# EAGLE design M32W.v1.0 (EAGLE 6.1)

## Sheet 1 of 3
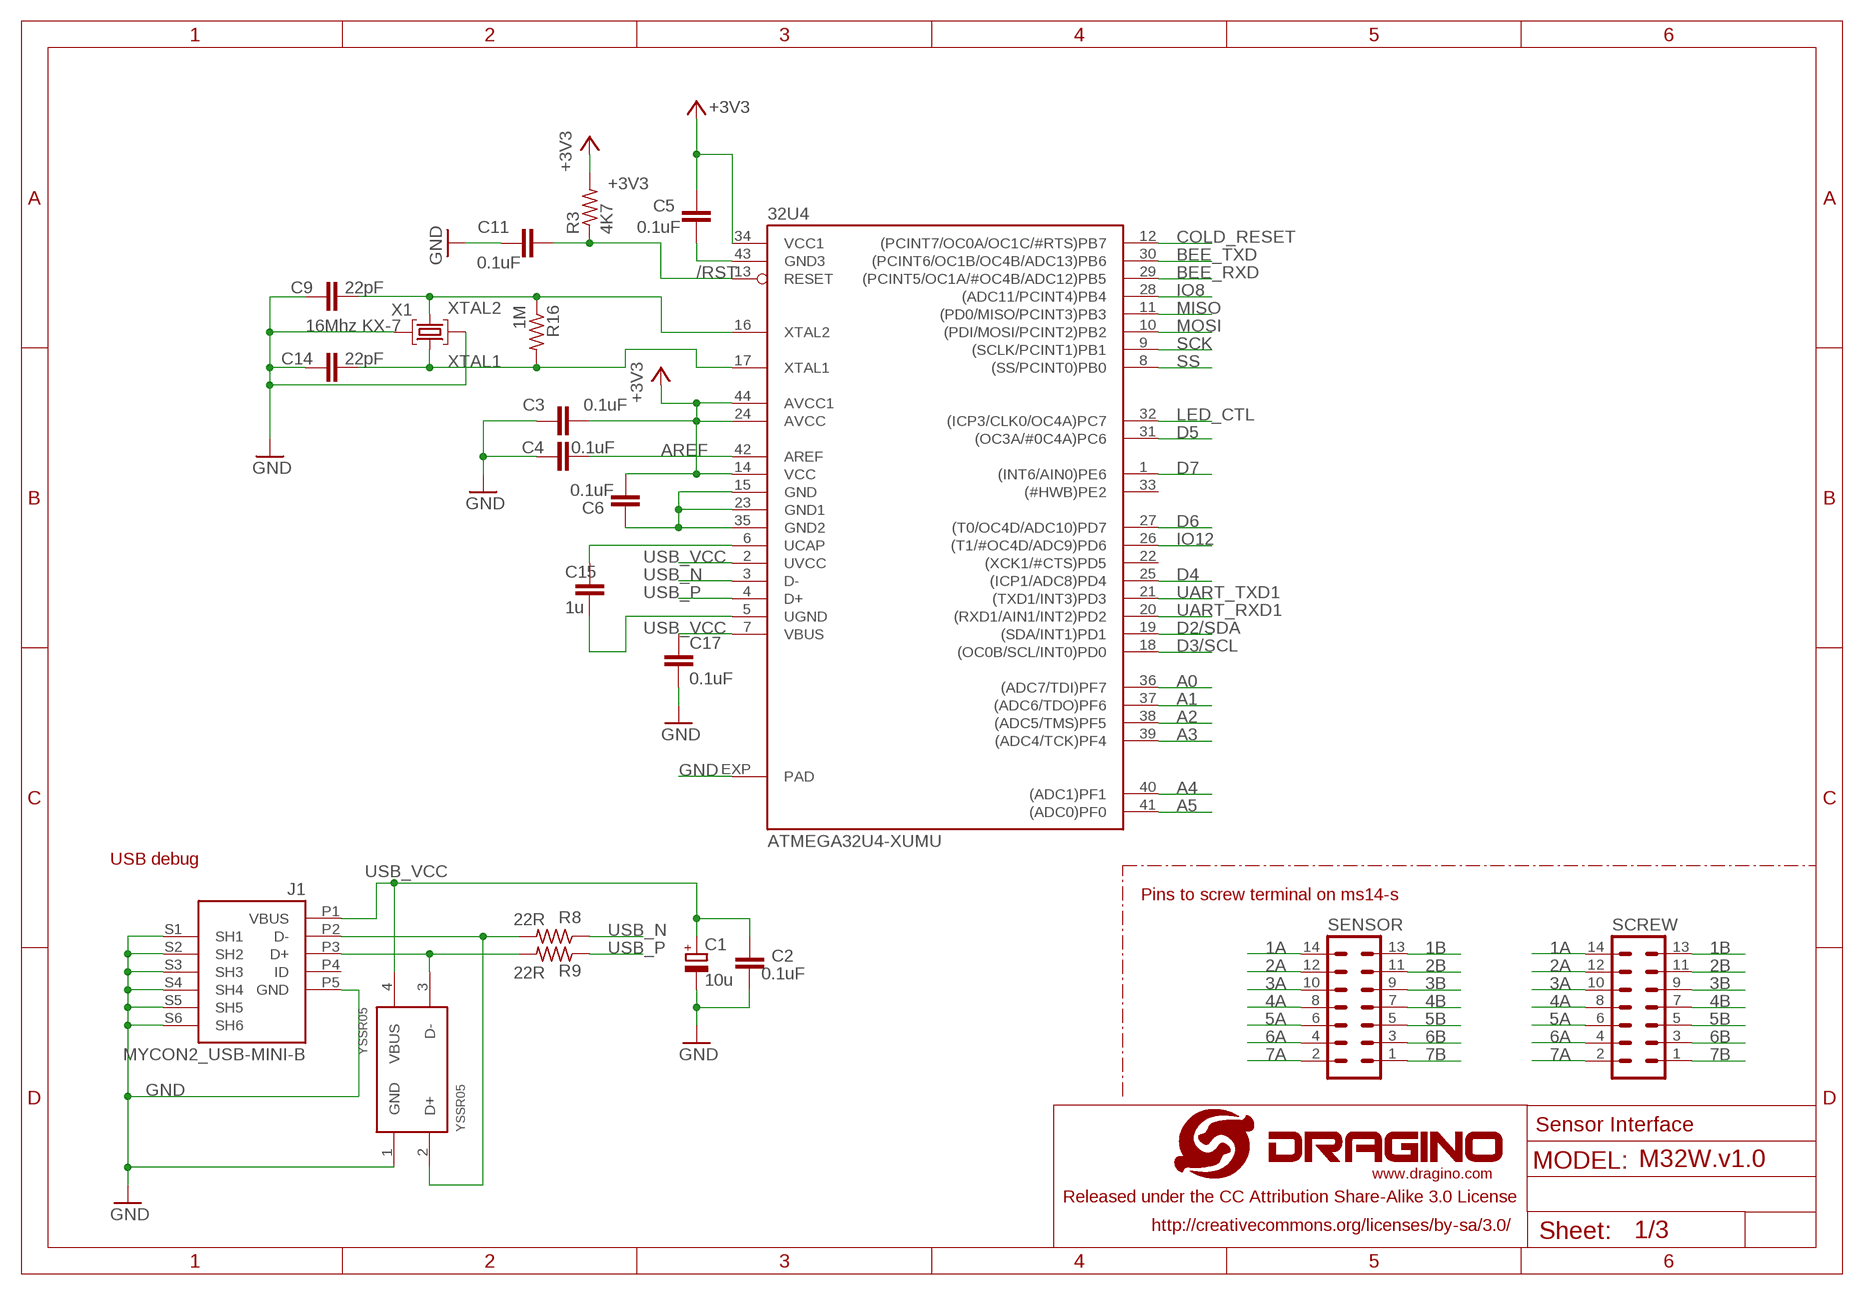
[diagram p0: schematic, sheet 1]

### Parts
32U4  ATMEGA32U4-XUMU  [QFN44ML7X7]
C1  10u  CPOL-EUSMCB  [SMC_B]
C2  0.1uF  C-EUC0402  [C0402]
C3  0.1uF  C-EUC0402  [C0402]
C4  0.1uF  C-EUC0402  [C0402]
C5  0.1uF  C-EUC0402  [C0402]
C6  0.1uF  C-EUC0402  [C0402]
C9  22pF  C-EUC0402  [C0402]
C11  0.1uF  C-EUC0402  [C0402]
C14  22pF  C-EUC0402  [C0402]
C15  1u  C-EUC0402  [C0402]
C17  0.1uF  C-EUC0402  [C0402]
J1  MYCON2_USB-MINI-B  [CON2_USB_MICRO_B_AT]
R3  4K7  R-US_R0402  [R0402]
R8  22R  R-US_R0402  [R0402]
R9  22R  R-US_R0402  [R0402]
R16  1M  R-US_R0402  [R0402]
SCREW  MA07-2  [MA07-2]
SENSOR  MA07-2  [MA07-2]
X1  16Mhz KX-7  CRYSTAL-3.2-2.5  [CRYSTAL-3.2-2.5]
YSSR05  YSSR05  [SOT143]

### Nets
1A: SCREW.14 SENSOR.14
1B: SCREW.13 SENSOR.13
2A: SCREW.12 SENSOR.12
2B: SCREW.11 SENSOR.11
3A: SCREW.10 SENSOR.10
3B: SCREW.9 SENSOR.9
4A: SCREW.8 SENSOR.8
4B: SCREW.7 SENSOR.7
5A: SCREW.6 SENSOR.6
5B: SCREW.5 SENSOR.5
6A: SCREW.4 SENSOR.4
6B: SCREW.3 SENSOR.3
7A: SCREW.2 SENSOR.2
7B: SCREW.1 SENSOR.1
+3V3: 32U4.14(VCC) 32U4.24(AVCC) 32U4.34(VCC1) 32U4.44(AVCC1) C3.2 C5.1 C6.2 R3.2 ; also sheet 2,3
/RST: 32U4.13(RESET) C11.1 R3.1 ; also sheet 2
A0: 32U4.36((ADC7/TDI)PF7) ; also sheet 2
A1: 32U4.37((ADC6/TDO)PF6) ; also sheet 2
A2: 32U4.38((ADC5/TMS)PF5) ; also sheet 2
A3: 32U4.39((ADC4/TCK)PF4) ; also sheet 2
A4: 32U4.40((ADC1)PF1) ; also sheet 2
A5: 32U4.41((ADC0)PF0) ; also sheet 2
AREF: 32U4.42(AREF) C4.2
BEE_RXD: 32U4.29((PCINT5/OC1A/#OC4B/ADC12)PB5) ; also sheet 2,3
BEE_TXD: 32U4.30((PCINT6/OC1B/OC4B/ADC13)PB6) ; also sheet 2,3
COLD_RESET: 32U4.12((PCINT7/OC0A/OC1C/#RTS)PB7) ; also sheet 2
D2/SDA: 32U4.19((SDA/INT1)PD1) ; also sheet 2
D3/SCL: 32U4.18((OC0B/SCL/INT0)PD0) ; also sheet 2,3
D4: 32U4.25((ICP1/ADC8)PD4) ; also sheet 2
D5: 32U4.31((OC3A/#0C4A)PC6) ; also sheet 2
D6: 32U4.27((T0/OC4D/ADC10)PD7) ; also sheet 2
D7: 32U4.1((INT6/AIN0)PE6)
GND [gnd]: 32U4.5(UGND) 32U4.15(GND) 32U4.23(GND1) 32U4.35(GND2) 32U4.43(GND3) 32U4.EXP(PAD) C1.- C2.2 C3.1 C4.1 C5.2 C6.1 C9.1 C11.2 C14.1 C15.1 C17.1 J1.P5(GND) J1.S1(SH1) J1.S2(SH2) J1.S3(SH3) J1.S4(SH4) J1.S5(SH5) J1.S6(SH6) X1.2(GND) X1.4(GND) YSSR05.1(GND) ; also sheet 2,3
IO8: 32U4.28((ADC11/PCINT4)PB4) ; also sheet 2
IO12: 32U4.26((T1/#OC4D/ADC9)PD6) ; also sheet 2
LED_CTL: 32U4.32((ICP3/CLK0/OC4A)PC7) ; also sheet 2
MISO: 32U4.11((PD0/MISO/PCINT3)PB3) ; also sheet 2,3
MOSI: 32U4.10((PDI/MOSI/PCINT2)PB2) ; also sheet 2,3
N$1: 32U4.6(UCAP) C15.2
N$2_N [usbtrace]: J1.P3(D+) R9.2 YSSR05.3(D-)
N$2_P [usbtrace]: J1.P2(D-) R8.2 YSSR05.2(D+)
SCK: 32U4.9((SCLK/PCINT1)PB1) ; also sheet 2,3
SS: 32U4.8((SS/PCINT0)PB0) ; also sheet 2,3
UART_RXD1: 32U4.20((RXD1/AIN1/INT2)PD2) ; also sheet 2
UART_TXD1: 32U4.21((TXD1/INT3)PD3) ; also sheet 2
USB_N [usbtrace]: 32U4.3(D-) R8.1
USB_P [usbtrace]: 32U4.4(D+) R9.1
USB_VCC: 32U4.2(UVCC) 32U4.7(VBUS) C1.+ C2.1 C17.2 J1.P1(VBUS) YSSR05.4(VBUS)
XTAL1: 32U4.17(XTAL1) C14.2 R16.2 X1.3(C2)
XTAL2: 32U4.16(XTAL2) C9.2 R16.1 X1.1(C1)
Unconnected: 32U4.22((XCK1/#CTS)PD5) 32U4.33((#HWB)PE2) J1.P4(ID)

### Notes on the sheet
- USB debug
- Pins to screw terminal on ms14-s
- Sensor Interface

## Sheet 2 of 3
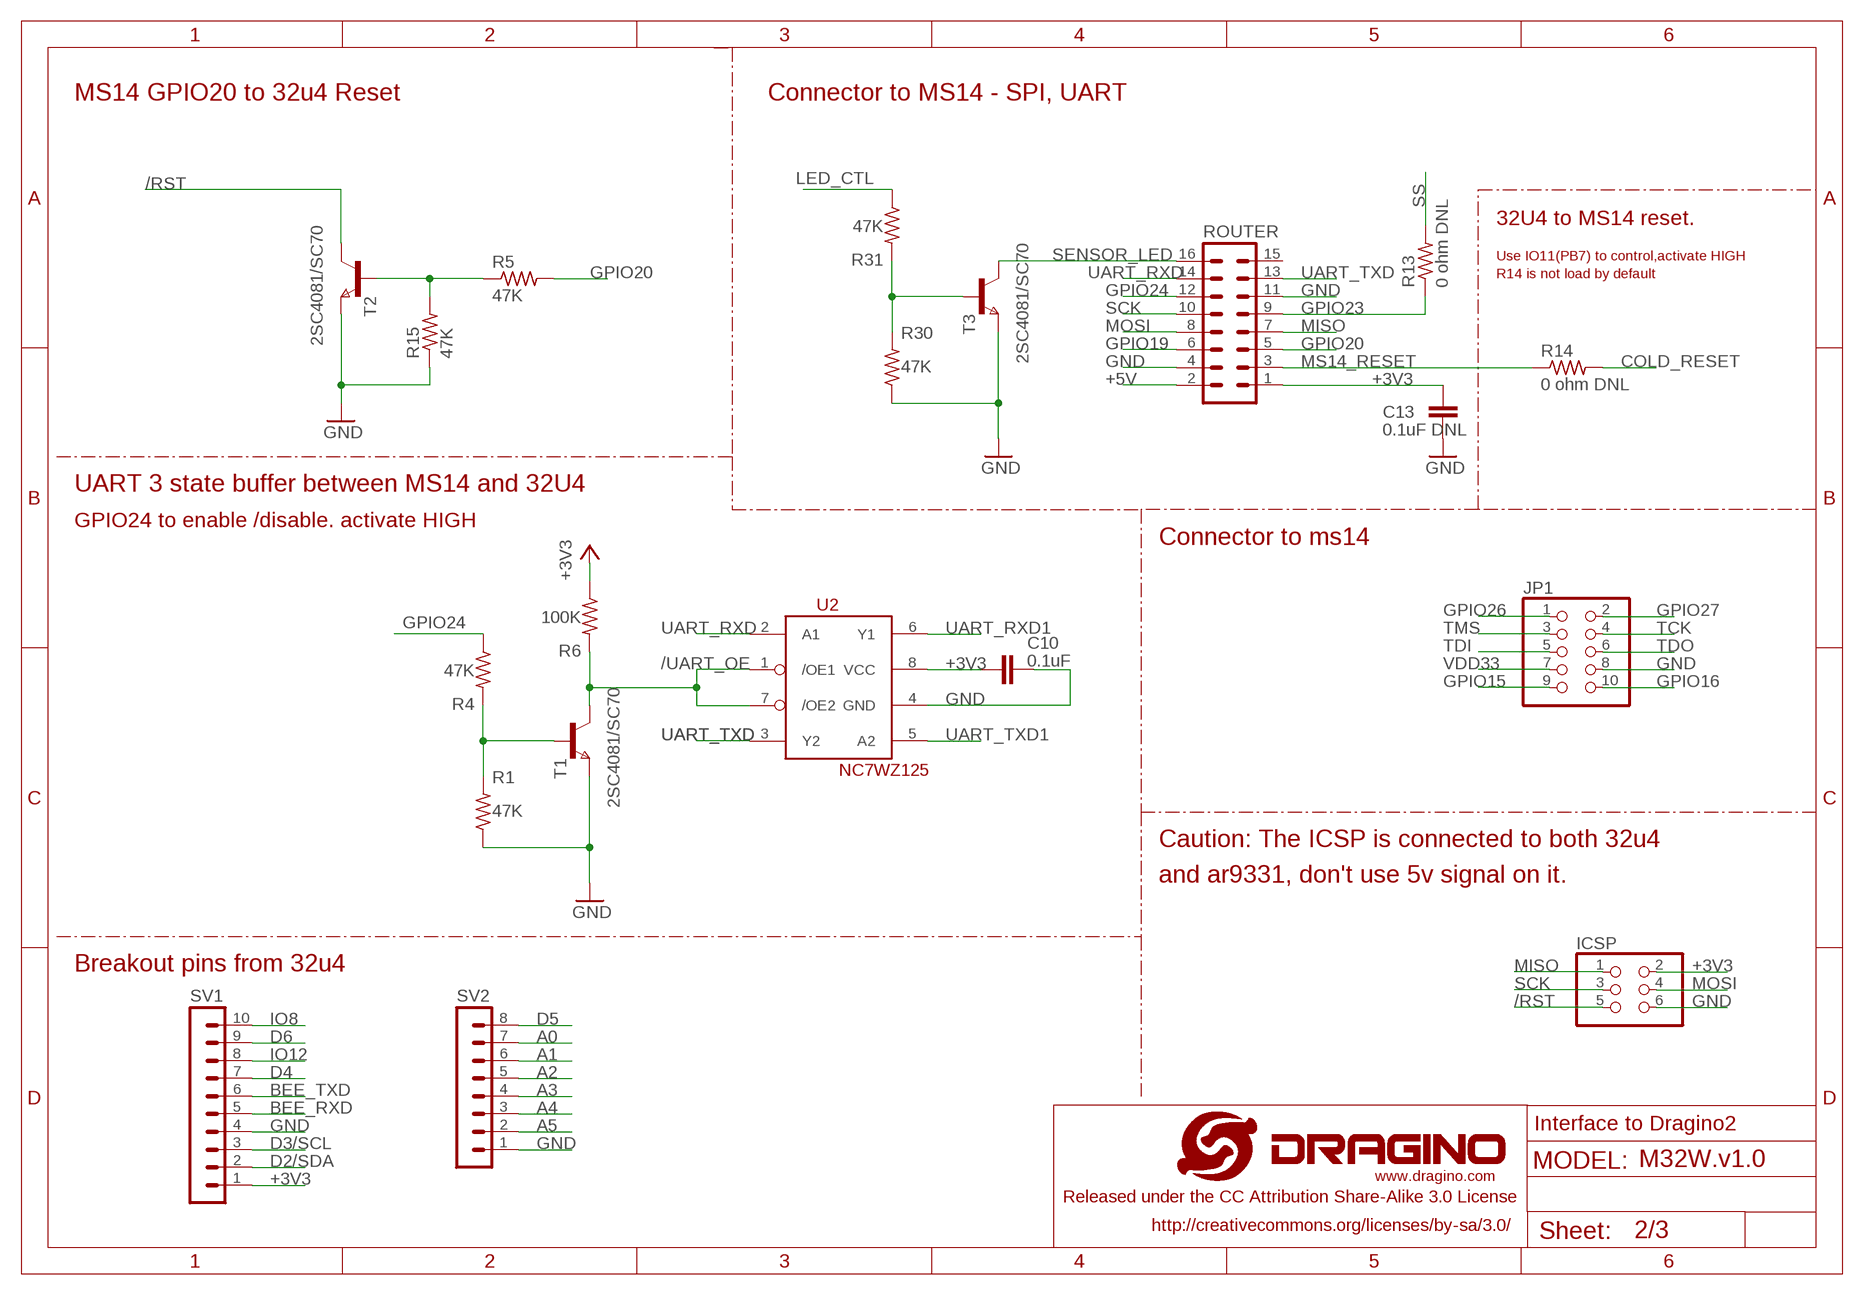
[diagram p1: schematic, sheet 2]

### Parts
C10  0.1uF  C-EUC0402  [C0402]
C13  0.1uF DNL  C-EUC0402  [C0402]
ICSP  PINHD-2X3  [2X03]
JP1  PINHD-2X5_2.00  [2X05M]
R1  47K  R-US_R0402  [R0402]
R4  47K  R-US_R0402  [R0402]
R5  47K  R-US_R0402  [R0402]
R6  100K  R-US_R0402  [R0402]
R13  0 ohm DNL  R-US_R0402  [R0402]
R14  0 ohm DNL  R-US_R0402  [R0402]
R15  47K  R-US_R0402  [R0402]
R30  47K  R-US_R0402  [R0402]
R31  47K  R-US_R0402  [R0402]
ROUTER  MA08-2  [MA08-2]
SV1  MA10-1  [MA10-1]
SV2  MA08-1  [MA08-1]
T1  2SC4081/SC70  NPNSOT323  [SOT323]
T2  2SC4081/SC70  NPNSOT323  [SOT323]
T3  2SC4081/SC70  NPNSOT323  [SOT323]
U2  NC7WZ125  [US8]
U$5  LOGO-NEW  [LOGO-SILK-NEW]

### Nets
+3V3: C10.2 C13.1 ICSP.2 R6.1 ROUTER.1 SV1.1 U2.8(VCC) ; also sheet 1,3
+5V: ROUTER.2
/RST: ICSP.5 T2.1(C) ; also sheet 1
/UART_OE: R6.2 T1.1(C) U2.1(/OE1) U2.7(/OE2)
A0: SV2.7 ; also sheet 1
A1: SV2.6 ; also sheet 1
A2: SV2.5 ; also sheet 1
A3: SV2.4 ; also sheet 1
A4: SV2.3 ; also sheet 1
A5: SV2.2 ; also sheet 1
BEE_RXD: SV1.5 ; also sheet 1,3
BEE_TXD: SV1.6 ; also sheet 1,3
COLD_RESET: R14.2 ; also sheet 1
D2/SDA: SV1.2 ; also sheet 1
D3/SCL: SV1.3 ; also sheet 1,3
D4: SV1.7 ; also sheet 1
D5: SV2.8 ; also sheet 1
D6: SV1.9 ; also sheet 1
GND [gnd]: C10.1 C13.2 ICSP.6 JP1.8 R1.1 R15.1 R30.1 ROUTER.4 ROUTER.11 SV1.4 SV2.1 T1.3(E) T2.3(E) T3.3(E) U2.4(GND) ; also sheet 1,3
GPIO15: JP1.9
GPIO16: JP1.10
GPIO19: ROUTER.6
GPIO20: R5.2 ROUTER.5
GPIO23: R13.1 ROUTER.9
GPIO24: R4.1 ROUTER.12
GPIO26: JP1.1 ; also sheet 3
GPIO27: JP1.2 ; also sheet 3
IO8: SV1.10 ; also sheet 1
IO12: SV1.8 ; also sheet 1
LED_CTL: R31.1 ; also sheet 1
MISO: ICSP.1 ROUTER.7 ; also sheet 1,3
MOSI: ICSP.4 ROUTER.8 ; also sheet 1,3
MS14_RESET: R14.1 ROUTER.3
N$4: R1.2 R4.2 T1.2(B)
N$8: R5.1 R15.2 T2.2(B)
N$9: R30.2 R31.2 T3.2(B)
SCK: ICSP.3 ROUTER.10 ; also sheet 1,3
SENSOR_LED: ROUTER.16 T3.1(C)
SS: R13.2 ; also sheet 1,3
TCK: JP1.4
TDI: JP1.5
TDO: JP1.6
TMS: JP1.3
UART_RXD: ROUTER.14 U2.2(A1) ; also sheet 3
UART_RXD1: U2.6(Y1) ; also sheet 1
UART_TXD: ROUTER.13 U2.3(Y2) ; also sheet 3
UART_TXD1: U2.5(A2) ; also sheet 1
VDD33: JP1.7
Unconnected: ROUTER.15

### Notes on the sheet
- MS14 GPIO20 to 32u4 Reset | Connector to MS14 - SPI, UART
- 32U4 to MS14 reset.
- Use IO11(PB7) to control,activate HIGH
- R14 is not load by default
- UART 3 state buffer between MS14 and 32U4
- GPIO24 to enable /disable. activate HIGH
- Connector to ms14
- Caution: The ICSP is connected to both 32u4
- and ar9331, don't use 5v signal on it.
- Breakout pins from 32u4
- Interface to Dragino2

## Sheet 3 of 3
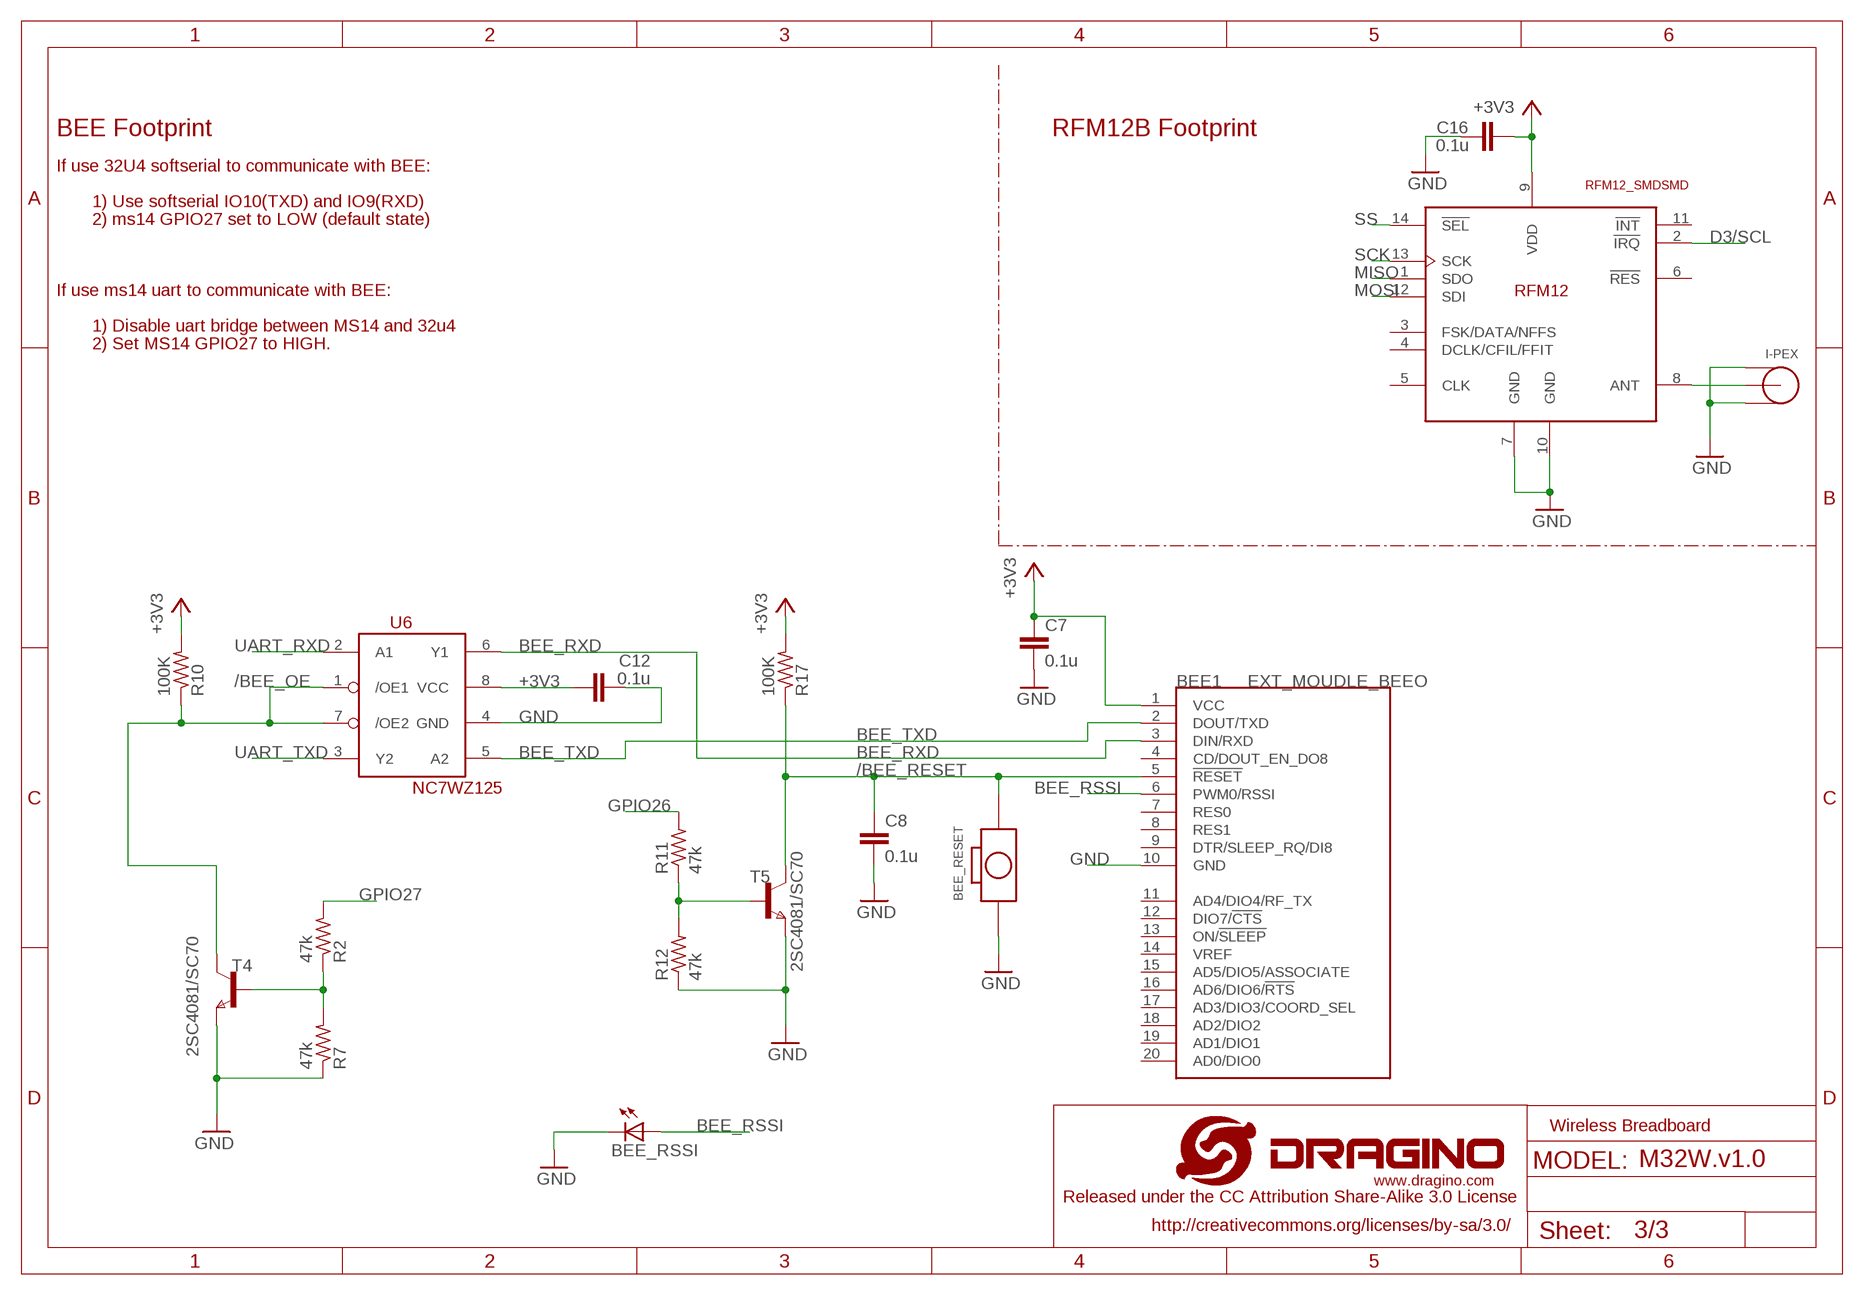
[diagram p2: schematic, sheet 3]

### Parts
BEE1  EXT_MOUDLE_BEEO  [EXT_MOUDLE_BEE]
BEE_RESET  CPT_SMD_BOTTON_1_SMD  [CPT_SMD_BOTTON_1]
BEE_RSSI  LEDCHIP-LED0805  [CHIP-LED0805]
C7  0.1u  C-EUC0402  [C0402]
C8  0.1u  C-EUC0402  [C0402]
C12  0.1u  C-EUC0402  [C0402]
C16  0.1u  C-EUC0402  [C0402]
I-PEX  I-PEX  [I-PEX]
R2  47k  R-US_R0402  [R0402]
R7  47k  R-US_R0402  [R0402]
R10  100K  R-US_R0402  [R0402]
R11  47k  R-US_R0402  [R0402]
R12  47k  R-US_R0402  [R0402]
R17  100K  R-US_R0402  [R0402]
T4  2SC4081/SC70  NPNSOT323  [SOT323]
T5  2SC4081/SC70  NPNSOT323  [SOT323]
U6  NC7WZ125  [US8]
U$3  RFM12_SMDSMD  [RFM12]

### Nets
+3V3: BEE1.1(VCC) C7.1 C12.1 C16.2 R10.2 R17.2 U6.8(VCC) U$3.9(VDD) ; also sheet 1,2
/BEE_OE: R10.1 T4.1(C) U6.1(/OE1) U6.7(/OE2)
/BEE_RESET: BEE1.5(!RESET) BEE_RESET.P$2 C8.1 R17.1 T5.1(C)
BEE_RSSI: BEE1.6(PWM0/RSSI) BEE_RSSI.A
BEE_RXD: BEE1.3(DIN/RXD) U6.6(Y1) ; also sheet 1,2
BEE_TXD: BEE1.2(DOUT/TXD) U6.5(A2) ; also sheet 1,2
D3/SCL: U$3.2(!IRQ) ; also sheet 1,2
GND [gnd]: BEE1.10(GND) BEE_RESET.1 BEE_RSSI.C C7.2 C8.2 C12.2 C16.1 I-PEX.GND I-PEX.GND1 R7.1 R12.1 T4.3(E) T5.3(E) U6.4(GND) U$3.7(GND) U$3.10(GND) ; also sheet 1,2
GPIO26: R11.2 ; also sheet 2
GPIO27: R2.2 ; also sheet 2
MISO: U$3.1(SDO) ; also sheet 1,2
MOSI: U$3.12(SDI) ; also sheet 1,2
N$11: R2.1 R7.2 T4.2(B)
N$12: R11.1 R12.2 T5.2(B)
N$16: I-PEX.SIG U$3.8(ANT)
SCK: U$3.13(SCK) ; also sheet 1,2
SS: U$3.14(!SEL) ; also sheet 1,2
UART_RXD: U6.2(A1) ; also sheet 2
UART_TXD: U6.3(Y2) ; also sheet 2
Unconnected: BEE1.4(CD/DOUT_EN_DO8) BEE1.7(RES0) BEE1.8(RES1) BEE1.9(DTR/SLEEP_RQ/DI8) BEE1.11(AD4/DIO4/RF_TX) BEE1.12(DIO7/!CTS) BEE1.13(ON/!SLEEP) BEE1.14(VREF) BEE1.15(AD5/DIO5/ASSOCIATE) BEE1.16(AD6/DIO6/!RTS) BEE1.17(AD3/DIO3/COORD_SEL) BEE1.18(AD2/DIO2) BEE1.19(AD1/DIO1) BEE1.20(AD0/DIO0) U$3.3(FSK/DATA/NFFS) U$3.4(DCLK/CFIL/FFIT) U$3.5(CLK) U$3.6(!RES) U$3.11(!INT)

### Notes on the sheet
- BEE Footprint | RFM12B Footprint
- If use 32U4 softserial to communicate with BEE:
- 1) Use softserial IO10(TXD) and IO9(RXD)
- 2) ms14 GPIO27 set to LOW (default state)
- If use ms14 uart to communicate with BEE:
- 1) Disable uart bridge between MS14 and 32u4
- 2) Set MS14 GPIO27 to HIGH.
- Wireless Breadboard

## Library data of the parts
32U4 = dragino:ATMEGA32U4-XU
BEE1 = Bees_Shield:EXT_MOUDLE_BEE
BEE_RESET = Bees_Shield:CPT_SMD_BOTTON_1
BEE_RSSI = dragino:LED: LED OSRAM: - CHIPLED LG R971, LG N971, LY N971, LG Q971, LY Q971, LO R971, LY R971 LH N974, LH R974 LS Q976, LO Q976, LY Q976 LO Q996 - Hyper CHIPLED LW Q18S LB Q993, LB Q99A, LB R99A - SideLED LS A670, LO A670, LY A670, LG A670, LP A670 LB A673, LV A673, LT A673, LW A673 LH A674 LY A675 LS A676, LA A676, LO A676, LY A676, LW A676 LS A679, LY A679, LG A679 - Hyper Micro SIDELED® LS Y876, LA Y876, LO Y876, LY Y876 LT Y87S - SmartLED LW L88C, LW L88S LB L89C, LB L89S, LG L890 LS L89K, LO L89K, LY L89K LS L896, LA L896, LO L896, LY L896 - TOPLED LS T670, LO T670, LY T670, LG T670, LP T670 LSG T670, LSP T670, LSY T670, LOP T670, LYG T670 LG T671, LOG T671, LSG T671 LB T673, LV T673, LT T673, LW T673 LH T674 LS T676, LA T676, LO T676, LY T676, LB T676, LH T676, LSB T676, LW T676 LB T67C, LV T67C, LT T67C, LS T67K, LO T67K, LY T67K, LW E67C LS E67B, LA E67B, LO E67B, LY E67B, LB E67C, LV E67C, LT E67C LW T67C LS T679, LY T679, LG T679 LS T770, LO T770, LY T770, LG T770, LP T770 LB T773, LV T773, LT T773, LW T773 LH T774 LS E675, LA E675, LY E675, LS T675 LS T776, LA T776, LO T776, LY T776, LB T776 LHGB T686 LT T68C, LB T68C - Hyper Mini TOPLED® LB M676 - Mini TOPLED Santana® LG M470 LS M47K, LO M47K, LY M47K Source: http://www.osram.convergy.de LUXEON: - LUMILED® LXK2-PW12-R00, LXK2-PW12-S00, LXK2-PW14-U00, LXK2-PW14-V00 LXK2-PM12-R00, LXK2-PM12-S00, LXK2-PM14-U00 LXK2-PE12-Q00, LXK2-PE12-R00, LXK2-PE12-S00, LXK2-PE14-T00, LXK2-PE14-U00 LXK2-PB12-K00, LXK2-PB12-L00, LXK2-PB12-M00, LXK2-PB14-N00, LXK2-PB14-P00, LXK2-PB14-Q00 LXK2-PR12-L00, LXK2-PR12-M00, LXK2-PR14-Q00, LXK2-PR14-R00 LXK2-PD12-Q00, LXK2-PD12-R00, LXK2-PD12-S00 LXK2-PH12-R00, LXK2-PH12-S00 LXK2-PL12-P00, LXK2-PL12-Q00, LXK2-PL12-R00 Source: www.luxeon.com KINGBRIGHT: KA-3528ASYC Source: www.kingbright.com
C1 = rcl:CPOL-EU: POLARIZED CAPACITOR, European symbol
C2-C17 = dragino:C-EU: CAPACITOR, European symbol
I-PEX = dragino:I-PEX: I-PEX connector
ICSP = dragino:PINHD-2X3: PIN HEADER
J1 = SmartPrj:MYCON2_USB-MINI-B
JP1 = dragino:PINHD-2X5: PIN HEADER
R1-R17 R30 R31 = dragino:R-US_: RESISTOR, American symbol
ROUTER = dragino:MA08-2: PIN HEADER; OC_FARNELL: unknown; OC_NEWARK: unknown
SCREW SENSOR = dragino:MA07-2: PIN HEADER; OC_FARNELL: unknown; OC_NEWARK: unknown
SV1 = con-lstb:MA10-1: PIN HEADER; OC_FARNELL: unknown; OC_NEWARK: unknown
SV2 = con-lstb:MA08-1: PIN HEADER; OC_FARNELL: unknown; OC_NEWARK: unknown
T1-T5 = zetex:NPNSOT323: NPN TRANSISTOR; MPN: DSS4160U-7; OC_FARNELL: 1710696; OC_NEWARK: 25R4558
U2 U6 = dragino:NC7WZ125: 3 state buffer: http://www.fairchildsemi.com/ds/NC/NC7WZ125.pdf
U$3 = dragino:RFM12_SMD: RFM12 is a low costing ISM band transceiver module implemented with unique PLL. It works signal ranges from 315/433/868/915MHZ bands, comply with FCC, ETSI regulation. The SPI interface is used to communicate with microcontroller for parameter setting.
U$5 = dragino:LOGO-NEW
X1 = SmartPrj:CRYSTAL-3.2-2.5
YSSR05 = dragino:YSSR05: Yeashin LOW CAPACITANCE TVS DIODE ARRAY http://www.yeashin.tw/download.php?id=4588

## Net classes
0 default: width 0.203 mm, clearance 0.254 mm
1 power: width 0.61 mm, drill 0.61 mm, clearance 0.254 mm
2 gnd: width 0.305 mm, drill 0.33 mm, clearance 0.254 mm
3 usbvcc: width 0.508 mm, drill 0.61 mm, clearance 0.254 mm
4 aref: width 0.406 mm, drill 0.61 mm, clearance 0.254 mm
5 usbtrace: width 0.254 mm, clearance 0.152 mm

## Board
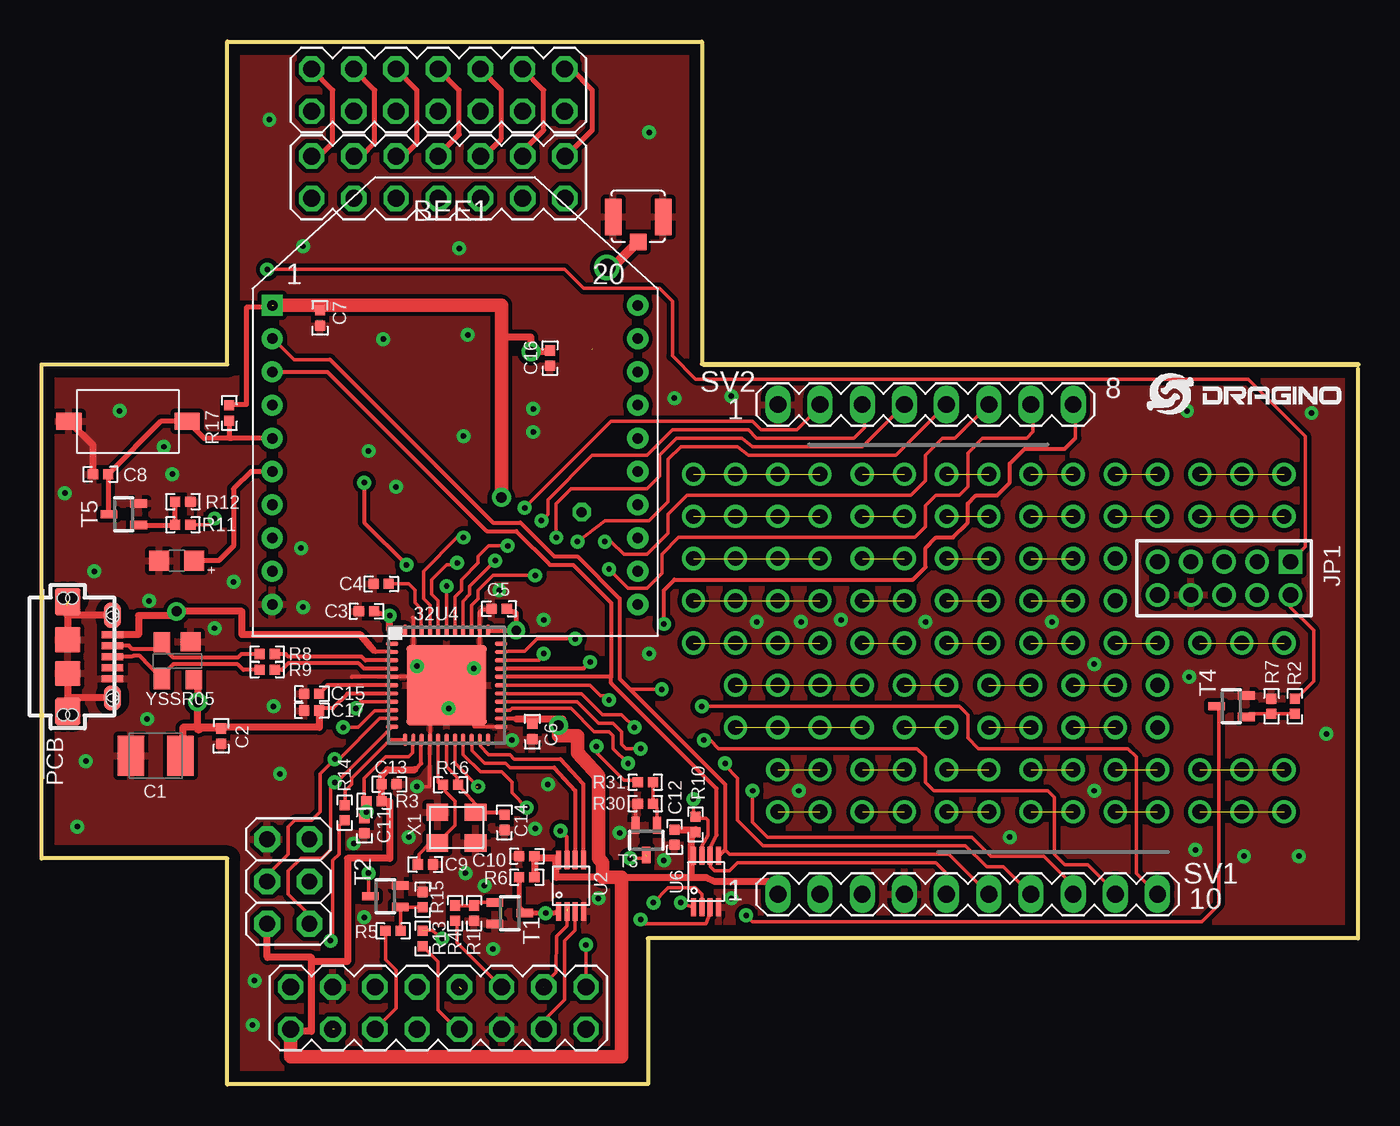
[diagram p3: board, top side]
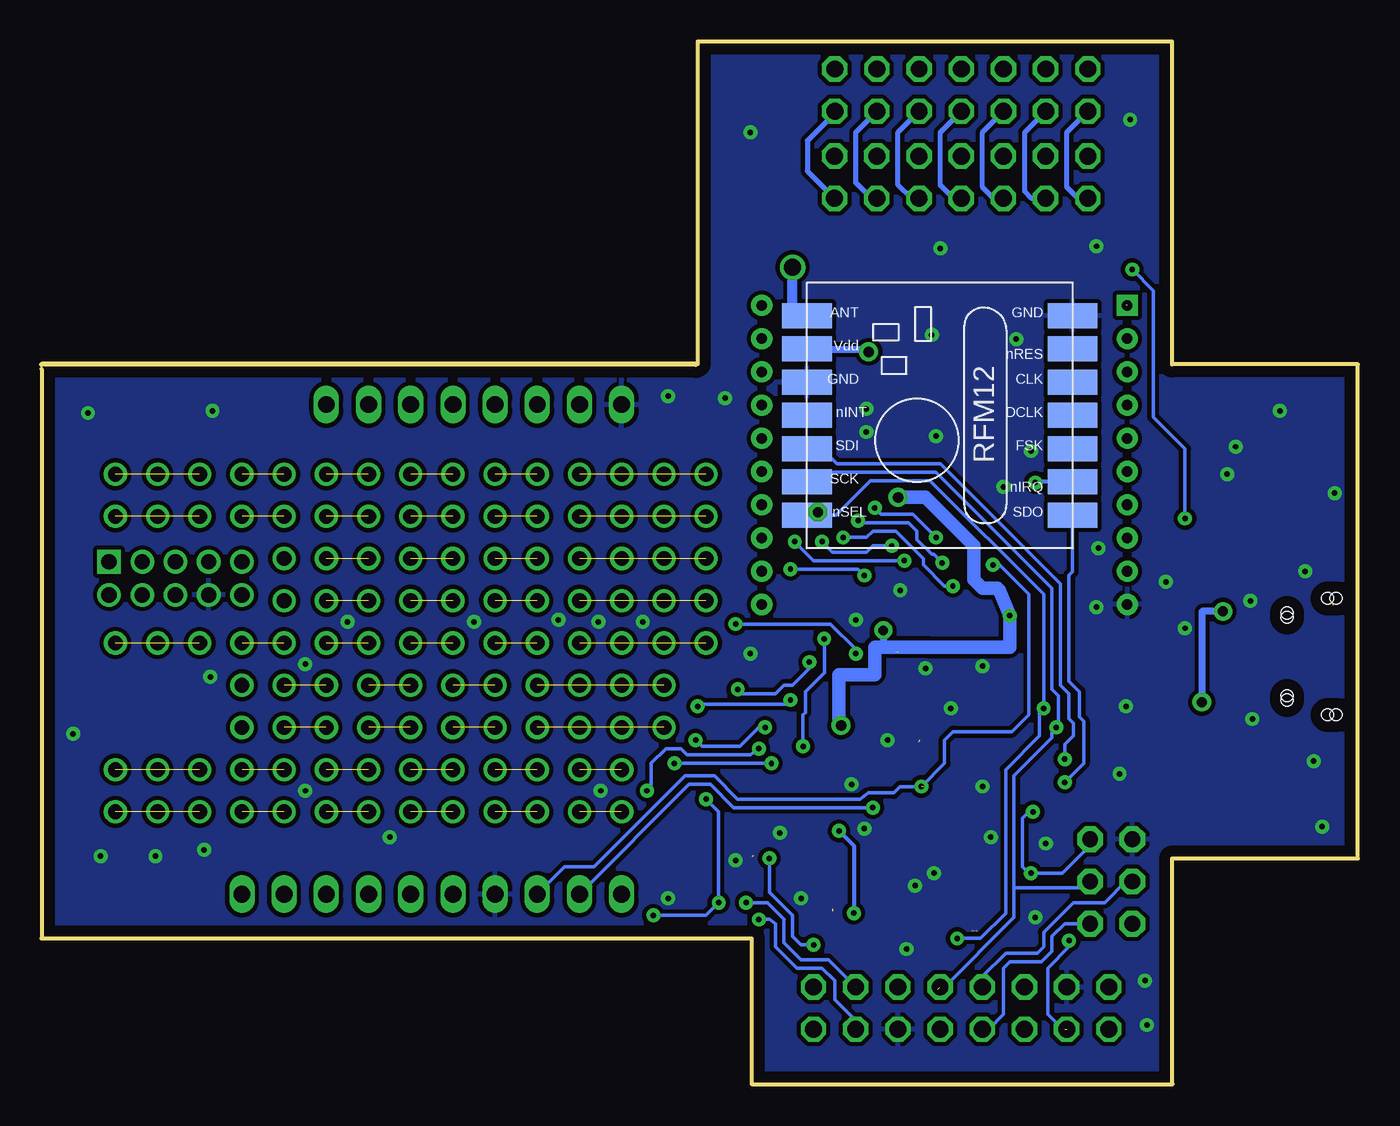
[diagram p4: board, bottom side, seen from below]

Size 79.25 x 62.75 mm. Coordinates in mm from the lower left corner, seen from the top.
Outline: 39.75,43.36 39.75,62.75 11.18,62.75 11.18,43.32 0,43.32 0,13.6 11.18,13.6 11.18,0
Outline: 79.25,43.04 79.25,8.78 36.51,8.78 36.51,0.02 11.16,0.02
Outline: 39.88,43.32 79.25,43.32
Copper layers (1*16): Top 0.035mm / dielectric 1.5mm / Bottom 0.035mm
Design rules: minimum track width 5mil, minimum drill 10mil, track to track 6mil, track to pad 7mil, pad to pad 7mil, via to via 10mil, smd to smd 7mil, copper to edge 26mil, drill to drill 10mil, minimum pad ring 10mil, minimum via ring 10mil, stop-mask expansion 1mil, vias tented up to drill 30mil, thermal gap 10mil

### Footprints (pad centres in the part's own frame; a part is rotated, then mirrored left to right if it is on the bottom)
QFN44ML7X7 = smd 0.75 x 0.275: 1 -3.275,2.5; 2 -3.275,2; 3 -3.275,1.5; 4 -3.275,1; 5 -3.275,0.5; 6 -3.275,0; 7 -3.275,-0.5; 8 -3.275,-1; 9 -3.275,-1.5; 10 -3.275,-2; 11 -3.275,-2.5; 23 3.275,-2.5; 24 3.275,-2; 25 3.275,-1.5; 26 3.275,-1; 27 3.275,-0.5; 28 3.275,0; 29 3.275,0.5; 30 3.275,1; 31 3.275,1.5; 32 3.275,2; 33 3.275,2.5 | smd 0.275 x 0.75: 12 -2.5,-3.275; 13 -2,-3.275; 14 -1.5,-3.275; 15 -1,-3.275; 16 -0.5,-3.275; 17 0,-3.275; 18 0.5,-3.275; 19 1,-3.275; 20 1.5,-3.275; 21 2,-3.275; 22 2.5,-3.275; 34 2.5,3.275; 35 2,3.275; 36 1.5,3.275; 37 1,3.275; 38 0.5,3.275; 39 0,3.275; 40 -0.5,3.275; 41 -1,3.275; 42 -1.5,3.275; 43 -2,3.275; 44 -2.5,3.275 | smd 4.826 x 4.826: EXP 0,0
EXT_MOUDLE_BEE = drill 0.635 pad 1.27 square: 1 -11,0 | drill 0.635 pad 1.27: 2 -11,-2; 3 -11,-4; 4 -11,-6; 5 -11,-8; 6 -11,-10; 7 -11,-12; 8 -11,-14; 9 -11,-16; 10 -11,-18; 11 11,-18; 12 11,-16; 13 11,-14; 14 11,-12; 15 11,-10; 16 11,-8; 17 11,-6; 18 11,-4; 19 11,-2; 20 11,0
CPT_SMD_BOTTON_1 = smd 1.524 x 1.016: 1 -3.556,0; P$2 3.556,0
CHIP-LED0805 = smd 1.2 x 1.2: A 0,-1.05; C 0,1.05
SMC_B = smd 1.6 x 2.4: + -1.5,0; - 1.5,0
C0402 = smd 0.61 x 0.61: 1 -0.457,0; 2 0.457,0
I-PEX = smd 1 x 2.2: GND -1.65,-0.27; GND1 1.35,-0.27 | smd 1 x 1: SIG -0.15,-1.77
2X03 = drill 0.95 pad 1.55 octagon: 1 -2.54,-1.27; 2 -2.54,1.27; 3 0,-1.27; 4 0,1.27; 5 2.54,-1.27; 6 2.54,1.27
CON2_USB_MICRO_B_AT = smd 0.406 x 1.346: P1 -1.321,2.692; P2 -0.66,2.692; P3 0,2.692; P4 0.66,2.692; P5 1.321,2.692 | smd 1.651 x 1.549: S1 -3.302,0; S2 3.302,0 | smd 1.524 x 1.016: S3 -2.489,2.692; S4 2.489,2.692 | smd 1.524 x 1.524: S5 -1.016,0; S6 1.016,0 | hole 0.7: -3.505,0.254; -3.505,-0.254; 3.505,0.254; 3.505,-0.254; -2.616,2.692; -2.362,2.692; 2.362,2.692; 2.616,2.692
2X05M = drill 0.914 square: 1 -4,-1 | drill 0.914: 2 -4,1; 3 -2,-1; 4 -2,1; 5 0,-1; 6 0,1; 7 2,-1; 8 2,1; 9 4,-1; 10 4,1
R0402 = smd 0.61 x 0.61: 1 -0.457,0; 2 0.457,0
MA08-2 = drill 1.016 octagon: 1 -8.89,-1.27; 2 -8.89,1.27; 3 -6.35,-1.27; 4 -6.35,1.27; 5 -3.81,-1.27; 6 -3.81,1.27; 7 -1.27,-1.27; 8 -1.27,1.27; 9 1.27,-1.27; 10 1.27,1.27; 11 3.81,-1.27; 12 3.81,1.27; 13 6.35,-1.27; 14 6.35,1.27; 15 8.89,-1.27; 16 8.89,1.27
MA07-2 = drill 1.016 octagon: 1 -7.62,-1.27; 2 -7.62,1.27; 3 -5.08,-1.27; 4 -5.08,1.27; 5 -2.54,-1.27; 6 -2.54,1.27; 7 0,-1.27; 8 0,1.27; 9 2.54,-1.27; 10 2.54,1.27; 11 5.08,-1.27; 12 5.08,1.27; 13 7.62,-1.27; 14 7.62,1.27
MA10-1 = drill 1.016 long: 1 -11.43,0; 2 -8.89,0; 3 -6.35,0; 4 -3.81,0; 5 -1.27,0; 6 1.27,0; 7 3.81,0; 8 6.35,0; 9 8.89,0; 10 11.43,0
MA08-1 = drill 1.016 long: 1 -8.89,0; 2 -6.35,0; 3 -3.81,0; 4 -1.27,0; 5 1.27,0; 6 3.81,0; 7 6.35,0; 8 8.89,0
SOT323 = smd 0.5 x 1: 1 0,0.9; 2 -0.65,-0.9; 3 0.65,-0.9
US8 = smd 0.3 x 1.1: 1 -0.75,-1.55; 2 -0.25,-1.55; 3 0.25,-1.55; 4 0.75,-1.55; 5 0.75,1.55; 6 0.25,1.55; 7 -0.25,1.55; 8 -0.75,1.55
RFM12 = smd 1.5 x 3: 1 -5,-10; 2 -3,-10; 3 -1,-10; 4 1,-10; 5 3,-10; 6 5,-10; 7 7,-10; 8 7,6; 9 5,6; 10 3,6; 11 1,6; 12 -1,6; 13 -3,6; 14 -5,6
CRYSTAL-3.2-2.5 = smd 1.3 x 1.05: 1 -1.15,-0.925; 2 1.15,-0.925; 3 1.15,0.925; 4 -1.15,0.925
SOT143 = smd 1.194 x 1.118: 1 -0.72,-1.181 | smd 0.991 x 1.194: 2 1.007,-1.143; 3 1.007,1.067 | smd 0.991 x 1.118: 4 -0.923,1.105

### Placement (x,y rotation side)
32U4  24.38,24.02 0 top
BEE1  24.89,46.88 0 top
BEE_RESET  5.21,39.89 0 top
BEE_RSSI  8.13,31.51 90 top
C1  6.87,19.78 180 top
C2  10.81,20.96 270 top
C3  19.56,28.46 0 top
C4  20.45,30.11 0 top
C5  27.55,28.63 180 top
C6  29.54,21.23 90 top
C7  16.76,46.12 270 top
C8  3.56,36.72 180 top
C9  23.11,13.23 180 top
C10  29.21,13.73 0 top
C11  19.43,15.56 270 top
C12  38.1,14.88 270 top
C13  20.93,18.05 0 top
C14  27.87,15.77 90 top
C15  16.26,23.51 0 top
C16  30.61,43.7 90 top
C17  16.26,22.49 0 top
I-PEX  36.07,52.47 0 top
ICSP  14.86,12.21 90 top
J1  1.58,25.74 270 top
JP1  71.18,30.45 180 top
R1  26.04,10.3 90 top
R2  75.44,22.75 90 top
R3  20.02,17.03 0 top
R4  24.89,10.3 90 top
R5  21.16,9.24 180 top
R6  29.21,12.46 180 top
R7  74.04,22.75 270 top
R8  13.59,25.9 180 top
R9  13.59,24.95 180 top
R10  39.37,15.64 270 top
R11  8.51,33.67 0 top
R12  8.51,35.07 180 top
R13  22.94,8.78 90 top
R14  18.24,16.35 90 top
R15  22.94,11.12 270 top
R16  24.63,18.02 0 top
R17  11.3,40.4 90 top
R30  36.35,16.89 0 top
R31  36.35,18.18 0 top
ROUTER  23.88,4.59 0 top
SCREW  23.88,59.83 0 top
SENSOR  23.88,54.59 0 top
SV1  55.75,11.45 0 top
SV2  53.21,40.91 0 top
T1  28.19,10.3 270 top
T2  20.7,11.32 90 top
T3  36.4,14.69 180 top
T4  71.63,22.75 90 top
T5  4.95,34.31 90 top
U2  31.88,11.95 0 top
U6  40.01,12.21 0 top
U$3  27.18,39.26 90 bottom
U$5  66.53,40.33 0 top
X1  24.98,15.45 0 top
YSSR05  8.26,25.45 180 top

### Tracks (layer width: path | path; a pad name or v marks a point on that pad's centre or on a via)
1A
  Top 0.305: SCREW.14 31.88,61.1 33.15,59.83 33.15,57.42 31.5,55.77 31.5,55.85 SENSOR.14
1B
  Bottom 0.305: SCREW.13 31.5,58.44 33.15,56.78 33.15,54.96 SENSOR.13
2A
  Top 0.305: SENSOR.12 28.96,56.16 30.23,57.42 30.23,59.83 SCREW.12
2B
  Bottom 0.305: SENSOR.11 29.3,53.32 30.23,54.24 30.23,57.29 SCREW.11
3A
  Top 0.305: SENSOR.10 26.63,55.86 27.69,56.91 27.69,59.83 SCREW.10
3B
  Bottom 0.305: SENSOR.9 26.89,53.32 27.69,54.12 27.69,57.29 SCREW.9
4A
  Top 0.305: SENSOR.8 23.88,55.9 25.15,57.17 25.15,59.83 SCREW.8
4B
  Bottom 0.305: SENSOR.7 24.35,53.32 25.15,54.12 25.15,57.29 SCREW.7
5A
  Top 0.305: SENSOR.6 21.81,55.86 22.61,56.66 22.61,59.83 SCREW.6
5B
  Bottom 0.305: SENSOR.5 21.93,53.32 22.61,53.99 22.61,57.29 SCREW.5
6A
  Top 0.305: SENSOR.4 19.27,55.86 20.07,56.66 20.07,59.83 SCREW.4
6B
  Bottom 0.305: SENSOR.3 19.65,53.32 20.07,53.74 20.07,57.29 SCREW.3
7A
  Top 0.305: SENSOR.2 16.73,55.86 17.53,56.66 17.53,59.83 SCREW.2
7B
  Bottom 0.305: SENSOR.1 16.85,53.32 17.53,53.99 17.53,57.29 SCREW.1
+3V3  (via drill 0.33 pad 0.64, 0.58 pad 0.81, 0.64)  (2 unrouted)
  Top 0.203: 20.45,17.03 R3.2 | U2.8 31.04,13.3 30.99,13.35 | 29.84,13.6 29.79,13.6 C10.2 | C7.1 16.76,46.75 16.64,46.88
  Top 0.254: U6.8 39.12,13.6 | 32U4.24 28.54,22.02 28.57,21.99 | 32U4.34 26.92,27.33 | 32U4.14 22.86,20.72 22.86,19.32 22.48,18.94 | 32U4.44 21.86,27.32 21.72,27.32 | v20.95,28.21 21.08,28.21
  Top 0.305: 26.92,27.33 v28.57,27.32 28.57,28.37 C5.1 | C3.2 20.9,28.21 v20.95,28.21 | BEE1.1 13.89,46.75 12.32,46.75 12.32,40.91 11.3,40.91 R17.2
  Top 0.406: 29.72,12.46 R6.1 C10.2 | 33.78,12.46 30.99,12.46 30.99,13.35 30.99,13.6 29.84,13.6 | 39.12,12.46 39.12,13.6 39.12,14.88 R10.2 | C12.1 39.37,15.33 R10.2 | 39.37,15.13 R10.2 | 28.57,21.99 29.54,21.99 | 29.54,21.99 31.37,21.99 31.37,21.86 v31.11,21.61 | C6.2 29.54,21.99 | 14.99,3.19 16.26,3.19 16.26,7.38 | 27.69,44.97 29.46,44.97 v29.46,44.09 30.61,44.09 C16.2 | ICSP.2 13.59,7.64 16.26,7.64 16.26,7.38 | 16.26,7.38 18.41,7.38 18.41,13.6 20.95,13.6 20.95,17.03 R3.2 | 20.45,17.03 20.45,18.05 C13.1 20.47,18.58 20.83,18.94 22.48,18.94 | 34.93,12.46 39.12,12.46 | 39.12,12.46 40.01,12.46 40.51,12.21 44.32,12.21 SV1.1 | 21.72,27.32 20.95,27.32 v20.95,28.21
  Top 0.813: ROUTER.1 14.99,3.32 14.99,3.19 14.99,1.67 34.93,1.67 34.93,12.46 33.78,12.46 33.78,13.35 33.53,13.6 33.53,18.56 32.26,19.95 32.26,20.97 31.11,20.97 v31.11,21.61 | v27.69,35.32 27.69,44.97 27.69,46.88 16.64,46.88 13.97,46.88
  Bottom 0.406: v28.57,27.32 28.57,26.3 25.91,26.3 | v29.46,44.09 29.46,44.21 33.15,44.21 | 31.24,21.48 v31.11,21.61
  Bottom 0.813: 31.24,21.48 31.24,24.65 29.08,24.65 29.08,26.3 25.91,26.3 20.95,26.3 v20.95,28.21 21.59,29.73 21.72,29.86 22.61,29.86 23.11,30.37 23.11,32.4 26.04,35.32 v27.69,35.32
/BEE_OE  (via drill 0.33 pad 0.64)
  Top 0.203: U6.7 39.76,14.37 40.13,15 40.13,15.89 40.01,16.02 39.45,16.02 R10.1 39.24,16.22 v39.24,17.16 | U6.1 38.56,10.86 v38.48,10.94 | T4.1 70.87,22.75 70.87,10.81 69.85,9.8 42.8,9.8 v42.42,10.18
  Bottom 0.203: v39.24,17.16 38.48,16.4 v38.48,10.94 39.24,10.18 v42.42,10.18
/BEE_RESET
  Top 0.305: BEE1.5 11.43,38.88 11.3,38.88 | 11.3,38.88 9.78,38.88 BEE_RESET.P$2 7.19,39.89 C8.1 4.01,34.35 T5.1 | R17.1 11.3,38.88
/RST  (via drill 0.33, 0.33 pad 0.64)
  Top 0.203: T2.1 19.68,11.32 v19.68,12.72 | 32U4.13 22.35,20.71 22.35,19.95 22.1,19.7 20.7,19.7 19.43,18.43 19.43,17.16 R3.1 v19.56,16.4 C11.1
  Bottom 0.203: v19.56,16.4 19.81,16.4 20.19,16.02 20.19,13.1 19.81,12.72 v19.68,12.72 17.78,12.72 16.13,14.37 ICSP.5
/UART_OE  (via drill 0.33 pad 0.64)
  Top 0.254: U2.7 31.62,13.31 31.62,14.88 v31.24,15.26
  Top 0.305: R6.2 28.75,10.64 T1.1 v30.35,10.3 30.83,10.3 U2.1
  Bottom 0.254: v31.24,15.26 30.35,14.37 v30.35,10.3
A0  (via drill 0.33 pad 0.64)
  Top 0.203: 32U4.36 25.88,28.82 26.29,29.23 26.29,29.73 27.18,30.62 v29.72,30.62 | SV2.7 59.69,40.78 59.69,39.26 59.31,38.88 56.64,38.88 55.75,37.99 55.75,35.96 55.25,35.45 53.85,35.45 53.21,34.81 53.21,33.54 52.58,32.91 38.35,32.91 37.34,31.89 37.34,30.75 36.45,29.86 35.31,29.86 v34.16,31
  Bottom 0.203: v29.72,30.62 30.1,31 v34.16,31
A1  (via drill 0.33 pad 0.64)
  Top 0.203: 32U4.37 25.38,29.08 25.78,29.48 25.78,29.99 v27.3,31.51 | v33.91,32.66 34.29,32.66 35.05,31.89 36.45,31.89 37.72,33.16 37.72,34.31 38.86,35.45 52.32,35.45 53.21,36.34 53.21,37.86 54.23,38.88 54.99,38.88 SV2.6
  Bottom 0.203: v33.91,32.66 32.77,31.51 v27.3,31.51
A2  (via drill 0.33 pad 0.64)
  Top 0.203: 32U4.38 24.88,29.34 25.27,29.73 25.27,30.37 26.29,31.38 26.29,31.77 26.92,32.4 v28.07,32.4 | v32.26,32.66 33.91,33.92 36.58,33.92 37.72,35.07 37.72,37.61 38.48,38.37 41.91,38.37 42.55,37.86 51.44,37.86 SV2.5
  Bottom 0.203: v28.07,32.4 29.21,32.4 29.59,32.02 31.62,32.02 v32.26,32.66
A3  (via drill 0.33 pad 0.64)
  Top 0.203: 32U4.39 v24.38,29.99 | SV2.4 49.4,38.37 42.8,38.37 42.16,38.88 38.23,38.88 37.21,37.86 37.21,36.59 36.45,35.83 31.88,35.83 30.99,34.94 v30.99,32.91
  Bottom 0.203: v24.38,29.99 24.89,29.99 26.16,31.26 26.16,31.64 27.81,33.29 29.21,33.29 29.59,32.91 v30.99,32.91
A4  (via drill 0.33 pad 0.64)
  Top 0.203: 32U4.40 23.88,29.09 23.49,29.48 23.49,30.37 24.38,31.26 24.89,31.26 v25.02,31.38 | SV2.3 49.53,40.78 49.53,39.51 48.9,38.88 43.05,38.88 42.55,39.39 37.97,39.39 36.45,37.86 33.15,37.86 30.48,35.2 30.48,34.31 v30.1,33.92
  Bottom 0.203: v25.02,31.38 25.53,31.89 25.65,31.89 26.54,32.78 26.54,33.29 27.05,33.8 29.97,33.8 v30.1,33.92
A5  (via drill 0.33 pad 0.64)
  Top 0.203: 32U4.41 23.38,28.83 22.99,29.23 22.99,30.88 25.02,32.91 v25.4,32.91 | SV2.2 46.99,40.91 45.47,39.39 43.31,39.39 42.8,39.89 34.29,39.89 v29.08,34.69
  Bottom 0.203: v25.4,32.91 26.8,34.31 28.7,34.31 v29.08,34.69
AREF
  Top 0.203: 32U4.42 22.86,27.29 22.86,28.59 22.48,28.97 22.48,29.73 22.1,30.11 C4.2
BEE_RSSI
  Top 0.305: BEE1.6 12.61,36.88 11.56,35.83 11.56,32.4 10.67,31.51 BEE_RSSI.A
BEE_RXD
  Top 0.203: 40.64,15 40.26,14.24 U6.6 40.26,13.55 40.26,13.1 40.51,12.84 41.4,12.84 41.91,13.35 53.85,13.35 54.48,12.72 SV1.5 54.61,11.32 | 32U4.29
  Top 0.254: 40.64,15 40.64,17.8 34.29,24.15 34.29,24.53 | 34.29,24.53 32U4.29 | BEE1.3 17.21,42.88 26.8,33.29 28.57,33.29 30.61,31.26 32,31.26 34.29,28.97 34.29,24.53
BEE_TXD  (via drill 0.33 pad 0.64)
  Top 0.203: U6.5 40.76,13.72 | 27.68,25.04 32U4.30 | 17.37,43.61 15.21,43.61 13.97,44.85 13.92,44.85 BEE1.2 | 41.15,14.11 41.4,13.86 54.61,13.86 SV1.6 | v37.34,23.76 35.43,23.76
  Top 0.254: 40.76,13.72 41.15,14.11 41.15,18.05 35.43,23.76 34.8,24.4 34.8,29.23 32.26,31.77 30.86,31.77 28.83,33.8 27.18,33.8 17.37,43.61 | 27.68,25.04 32.64,25.04 v33.02,25.42
  Bottom 0.203: v33.02,25.42 33.02,25.04 34.04,24.02 34.54,24.02 35.05,23.51 37.08,23.51 v37.34,23.76
COLD_RESET
  Top 0.203: 32U4.12 20.98,20.74 18.67,18.43 18.67,18.05 18.29,17.67 18.29,16.78 18.27,16.78 R14.2
D2/SDA  (via drill 0.33 pad 0.64)
  Top 0.203: 32U4.19 25.38,19.84 26.42,18.81 27.69,18.81 28.32,18.18 28.32,17.54 v29.21,16.65
  Bottom 0.203: v29.21,16.65 37.59,16.65 38.99,18.05 40.26,18.05 SV1.2
D3/SCL  (via drill 0.33 pad 0.64)  (1 unrouted)
  Top 0.203: 24.89,20.74 24.89,19.32 v26.29,17.92
  Top 0.254: v19.43,36.21 19.43,33.8 v21.97,31.26 | 24.89,20.74 32U4.18
  Bottom 0.203: v21.97,31.26 21.59,31.26 19.81,29.48 19.81,22.24 20.83,21.22 24.38,21.22 24.89,20.72 24.89,19.32 v26.29,17.92 | 26.16,17.92 27.56,17.92 27.94,17.54 29.46,17.54 29.97,17.16 37.34,17.16 38.73,18.56 40.51,18.56 45.97,13.1 47.75,13.1 SV1.3
  Bottom 0.254: U$3.2 19.38,36.26 v19.43,36.21
D4  (via drill 0.33)
  Top 0.203: 32U4.25 28.22,22.52 28.32,22.62 31.88,22.62 33.27,21.22 34.16,21.22 34.42,20.97 34.42,20.21 v35.31,19.32 | v41.15,19.32 41.15,19.19 41.91,18.43 41.91,15.89 43.43,14.37 55.63,14.37 56.9,13.1 57.91,13.1 SV1.7
  Bottom 0.203: v35.31,19.32 v41.15,19.32
D5  (via drill 0.33 pad 0.64)
  Top 0.203: 32U4.31 29.95,25.52 v30.23,25.92 | 62.23,38.88 62.23,40.91 62.1,41.04 SV2.8
  Top 0.254: v37.47,27.7 37.47,29.73 38.1,30.37 52.45,30.37 53.21,31.13 53.21,32.27 53.85,32.91 54.86,32.91 55.75,33.8 55.75,34.94 56.26,35.45 57.53,35.45 58.29,36.21 58.29,37.35 59.18,38.24 61.6,38.24 62.23,38.88
  Bottom 0.203: v30.23,25.92 30.23,26.18 31.75,27.7 v37.47,27.7
D6  (via drill 0.33 pad 0.64)
  Top 0.203: 32U4.27 32.5,23.52 33.78,22.24 34.93,22.24 v35.69,21.48 | SV1.9 64.77,11.45 62.99,13.22 61.6,13.22 60.96,13.86 60.96,17.29 60.58,17.67 53.72,17.67 53.21,18.18 53.21,19.7 52.71,20.21 40.77,20.21 40.26,20.72 v39.88,20.72
  Bottom 0.203: v35.69,21.48 36.07,21.48 37.21,20.34 39.5,20.34 v39.88,20.72
GND  (via drill 0.33 pad 0.64, 0.33 pad 0.81)  (1 unrouted)
  Top 0.203: T3.3 35.75,16.76 R30.1 | 32U4.35 26.38,26.15 26.29,26.05 26.29,24.02 32U4.EXP | v22.61,17.92 23.37,17.92 23.37,20.74 32U4.15 23.38,21.99 24,21.99 | 32U4.23 26.04,21.52 26.04,21.99 24,21.99 | v24.51,22.62 24,22.62 24,21.99 | 22.35,26.05 22.61,26.05 v22.61,25.16 22.99,25.16 22.99,24.65 22.22,24.65 22.22,24.53
  Top 0.254: 32U4.35 26.38,28.43 26.54,28.59 27.06,28.59 C5.2 | 18.67,24.53 32U4.5 22.47,24.52 22.48,24.53 22.22,24.53 22.22,24.52 | 22.35,26.05 22.38,26.08 32U4.43 22.38,28.05 22.35,28.08
  Top 0.406: C8.2 3.1,38.45 BEE_RESET.1 | J1.S3 1.52,28.23 1.52,28.84 | J1.S1 J1.S5 | J1.S6 1.52,24.73 1.52,24.53 1.58,24.53 J1.S2 1.58,23.25 J1.S4
  other vias: 18.8,14.49 14.35,18.68 13.97,22.75 12.83,6.24 12.7,3.57 19.43,10.05 26.67,11.95 25.53,12.72 22.1,14.88 27.18,8.14 33.53,11.19 29.72,15.38 34.8,15.13 30.48,18.05 41.53,11.19 45.59,17.67 58.29,14.88 63.37,17.67 69.47,14.11 72.39,13.73 75.69,13.73 77.34,21.1 68.96,40.53 76.45,40.4 69.09,24.53 38.1,41.29 41.53,41.42 30.23,27.96 29.59,39.26 36.58,25.92 20.57,44.85 25.65,45.1 21.34,35.96 29.59,40.66 25.4,39 15.75,50.44 25.15,50.31 36.58,57.29 13.72,58.05 1.4,35.58 4.7,40.53 7.87,36.72 7.37,38.37 3.17,30.88 6.35,21.99 2.16,15.51 2.67,19.45 6.48,29.1 10.41,27.45 26.04,25.04 27.56,29.73 43.05,27.83 45.72,27.83 48.13,27.96 53.21,27.83 60.83,27.83 63.37,25.29 28.32,20.72 37.47,13.48 15.75,28.72 11.56,30.24 19.68,38.12 15.62,32.27
  pour Top (rank 2): 11.18,43.32 11.18,62.79 39.75,62.66 39.75,43.32 79.02,43.32 79.27,8.78 43.69,8.68 36.56,8.64 36.7,0.14 12.07,0.02 11.05,0.02 11.05,13.6 0,13.6 0,13.73 0.13,43.32
  pour Bottom (rank 2): 0.13,43.2 0,13.6 11.18,13.6 11.18,0.14 11.3,0.14 36.58,0.02 36.44,8.68 79.27,8.78 79.02,43.37 39.7,43.37 39.75,62.75 10.92,62.75 11.43,43.07
GPIO20
  Top 0.203: ROUTER.5 21.34,4.58 21.34,6.87 20.7,7.51 R5.2
GPIO23
  Top 0.203: R13.1 23.88,7.38 23.88,4.46 25.02,3.32 ROUTER.9
GPIO24
  Top 0.203: ROUTER.12 25.02,8.53 25.02,9.72 R4.1
GPIO26  (via drill 0.33)
  Top 0.203: R11.2 10.03,33.67 v10.41,34.05 | v13.59,49.04 31.5,49.04 32.64,47.89 37.21,47.89 37.97,47.13 37.97,43.83 39.37,42.43 72.64,42.43 76.07,39 76.07,32.34 JP1.1
  Bottom 0.203: v10.41,34.05 10.41,38.24 12.32,40.15 12.32,47.77 v13.59,49.04
GPIO27
  Top 0.203: JP1.2 75.18,28.72 76.58,27.32 76.58,24.27 75.44,23.13 R2.2
H1  (via drill 0.89 pad 1.27)  (3 unrouted)
  other vias: 44.32,36.72 46.86,36.72 41.78,36.72 39.24,36.72
IO8  (via drill 0.33 pad 0.64)
  Top 0.203: 32U4.28 33.02,24.02 33.66,23.38 33.91,23.38 v34.16,23.13 | v39.75,22.75 55.25,22.75 55.75,22.24 55.75,20.84 56.39,20.21 65.41,20.21 65.91,19.7 65.91,12.72 SV1.10
  Bottom 0.203: v34.16,23.13 34.42,22.88 39.37,22.88 v39.75,22.75
IO12  (via drill 0.33 pad 0.64)
  Top 0.203: SV1.8 62.1,11.95 60.33,13.73 57.15,13.73 56.01,14.88 43.69,14.88 42.8,15.76 v42.8,17.67 | 32U4.26 32.24,23.02 33.53,21.73 34.42,21.73 34.93,21.22 34.93,20.46 35.18,20.21 v36.07,20.21
  Bottom 0.203: v36.07,20.21 36.58,19.83 40.39,19.83 40.77,20.21 41.66,20.21 42.55,19.32 42.55,17.92 v42.8,17.67
LED_CTL  (via drill 0.33 pad 0.64)  (1 unrouted)
  Top 0.203: R31.1 35.82,18.3 35.05,18.3 33.4,19.95 v33.4,20.34 | v32.13,26.81 29.84,26.81 29.08,26.05 27.81,26.05
  Bottom 0.203: v33.4,20.34 33.4,22.24 33.27,22.37 33.27,23.64 32.13,24.78 v32.13,26.81
MISO  (via drill 0.33 pad 0.64)
  Top 0.203: 32U4.11 17.77,18.18 v17.65,18.18 17.4,17.92 17.4,14.11 16.89,13.6 15.62,13.6 14.86,12.84 14.86,11.45 16.13,10.18 ICSP.1
  Bottom 0.203: ICSP.1 17.65,9.67 18.41,8.91 18.41,8.02 19.05,7.38 20.95,7.38 21.34,7 21.34,4.21 22.22,3.32 ROUTER.7 | U$3.1 17.18,30.84 17.4,30.62 17.4,24.27 16.76,23.64 16.76,22.11 16.51,21.86 16.51,19.32 v17.65,18.18
MOSI  (via drill 0.33 pad 0.64)
  Top 0.203: 32U4.10 20.35,22.02 17.91,19.57 v17.65,19.57 16.76,18.68 16.76,16.4 16.26,15.89 15.24,15.89 14.86,15.51 14.86,13.86 13.59,12.59 ICSP.4
  Bottom 0.203: ICSP.4 13.97,12.21 15.24,10.94 17.14,10.94 18.92,9.16 18.92,8.27 19.3,7.89 21.21,7.89 22.61,6.49 22.61,5.86 ROUTER.8 | v17.65,19.57 17.65,20.46 17.14,20.97 17.14,21.73 17.4,21.99 17.4,23.51 17.91,24.02 17.91,30.11 25.15,37.35 31.37,37.35 32.26,38.24 32.77,38.24 32.78,38.26 U$3.12
MS14_RESET  (via drill 0.33 pad 0.64)  (1 unrouted)
  Top 0.203: R14.1 17.91,15.55 17.91,13.86 17.53,13.48 17.53,8.65 v17.4,8.65
  Bottom 0.203: v17.4,8.65 17.4,8.27 18.67,7 18.67,4.21 17.78,3.32 17.65,3.32
N$1
  Top 0.254: 32U4.6 17.22,24.02 C15.2
N$2  (via drill 0.89 pad 1.27)  (1 unrouted)
  other vias: 49.4,36.72 51.94,36.72
N$2_N
  Top 0.254: R9.2 12.14,24.95 11.81,25.28 7.94,25.28 7.26,24.59 YSSR05.3 5.92,25.78 5.52,25.78 5.42,25.74 J1.P3
N$2_P
  Top 0.254: R8.2 12.02,25.89 11.81,25.68 7.94,25.68 7.26,26.36 YSSR05.2 6.85,26.19 5.46,26.19 5.25,26.4 J1.P2
N$3  (via drill 0.89 pad 1.27)  (1 unrouted)
  other vias: 54.48,36.72 57.02,36.72
N$4
  Top 0.203: R4.2 R1.2 26.23,10.95 T1.2
N$5  (via drill 0.89 pad 1.27)  (1 unrouted)
  other vias: 59.56,36.72 62.1,36.72
N$7  (via drill 0.89 pad 1.27)  (1 unrouted)
  other vias: 64.64,36.72 67.18,36.72
N$8
  Top 0.203: R5.1 21.61,10.66 T2.2 23.05,10.67 R15.2
N$9
  Top 0.203: T3.2 37.05,16.65 R30.2 R31.2
N$10  (via drill 0.89 pad 1.27)  (2 unrouted)
  other vias: 69.72,36.72 72.26,36.72 74.8,36.72
N$11
  Top 0.203: R2.1 R7.2 72.72,22.29 T4.2
N$12
  Top 0.305: T5.2 8.04,33.66 R11.1 R12.2
N$13  (via drill 0.89 pad 1.27)  (3 unrouted)
  other vias: 44.32,34.18 46.86,34.18 41.78,34.18 39.24,34.18
N$14  (via drill 0.89 pad 1.27)  (1 unrouted)
  other vias: 49.4,34.18 51.94,34.18
N$15  (via drill 0.89 pad 1.27)  (1 unrouted)
  other vias: 54.48,34.18 57.02,34.18
N$16  (via drill 1.02)
  Top 0.61: 35.7,50.7 I-PEX.SIG 34.39,49.16 v34.04,49.16
  Bottom 0.254: 32.89,46.24 33.16,46.24 U$3.8 33.77,46.26 33.78,46.24 34.04,46.24
  Bottom 0.61: 34.04,46.24 v34.04,49.16
N$17  (via drill 0.89 pad 1.27)  (1 unrouted)
  other vias: 59.56,34.18 62.1,34.18
N$18  (via drill 0.89 pad 1.27)  (1 unrouted)
  other vias: 64.64,34.18 67.18,34.18
N$19  (via drill 0.89 pad 1.27)  (2 unrouted)
  other vias: 69.72,34.18 72.26,34.18 74.8,34.18
N$20  (via drill 0.89 pad 1.27)  (3 unrouted)
  other vias: 44.32,31.64 46.86,31.64 41.78,31.64 39.24,31.64
N$21  (via drill 0.89 pad 1.27)  (1 unrouted)
  other vias: 49.4,31.64 51.94,31.64
N$22  (via drill 0.89 pad 1.27)  (1 unrouted)
  other vias: 54.48,31.64 57.02,31.64
N$23  (via drill 0.89 pad 1.27)  (1 unrouted)
  other vias: 59.56,31.64 62.1,31.64
N$24  (via drill 0.89 pad 1.27)
  other vias: 64.64,31.64
N$25  (via drill 0.89 pad 1.27)  (3 unrouted)
  other vias: 44.32,29.1 46.86,29.1 41.78,29.1 39.24,29.1
N$26  (via drill 0.89 pad 1.27)  (1 unrouted)
  other vias: 49.4,29.1 51.94,29.1
N$27  (via drill 0.89 pad 1.27)  (1 unrouted)
  other vias: 54.48,29.1 57.02,29.1
N$28  (via drill 0.89 pad 1.27)  (1 unrouted)
  other vias: 59.56,29.1 62.1,29.1
N$29  (via drill 0.89 pad 1.27)
  other vias: 64.64,29.1
N$30  (via drill 0.89 pad 1.27)  (3 unrouted)
  other vias: 44.32,26.56 46.86,26.56 41.78,26.56 39.24,26.56
N$31  (via drill 0.89 pad 1.27)  (1 unrouted)
  other vias: 49.4,26.56 51.94,26.56
N$32  (via drill 0.89 pad 1.27)  (1 unrouted)
  other vias: 54.48,26.56 57.02,26.56
N$33  (via drill 0.89 pad 1.27)  (1 unrouted)
  other vias: 59.56,26.56 62.1,26.56
N$34  (via drill 0.89 pad 1.27)  (1 unrouted)
  other vias: 64.64,26.56 67.18,26.56
N$35  (via drill 0.89 pad 1.27)  (2 unrouted)
  other vias: 69.72,26.56 72.26,26.56 74.8,26.56
N$36  (via drill 0.89 pad 1.27)  (3 unrouted)
  other vias: 46.86,24.02 49.4,24.02 44.32,24.02 41.78,24.02
N$37  (via drill 0.89 pad 1.27)  (1 unrouted)
  other vias: 51.94,24.02 54.48,24.02
N$38  (via drill 0.89 pad 1.27)  (1 unrouted)
  other vias: 57.02,24.02 59.56,24.02
N$39  (via drill 0.89 pad 1.27)  (1 unrouted)
  other vias: 62.1,24.02 64.64,24.02
N$40  (via drill 0.89 pad 1.27)
  other vias: 67.18,24.02
N$41  (via drill 0.89 pad 1.27)  (3 unrouted)
  other vias: 46.86,21.48 49.4,21.48 44.32,21.48 41.78,21.48
N$42  (via drill 0.89 pad 1.27)  (1 unrouted)
  other vias: 51.94,21.48 54.48,21.48
N$43  (via drill 0.89 pad 1.27)  (1 unrouted)
  other vias: 57.02,21.48 59.56,21.48
N$44  (via drill 0.89 pad 1.27)  (1 unrouted)
  other vias: 62.1,21.48 64.64,21.48
N$45  (via drill 0.89 pad 1.27)
  other vias: 67.18,21.48
N$46  (via drill 0.89 pad 1.27)  (1 unrouted)
  other vias: 44.32,18.94 46.86,18.94
N$47  (via drill 0.89 pad 1.27)  (1 unrouted)
  other vias: 49.4,18.94 51.94,18.94
N$48  (via drill 0.89 pad 1.27)  (1 unrouted)
  other vias: 54.48,18.94 57.02,18.94
N$49  (via drill 0.89 pad 1.27)  (1 unrouted)
  other vias: 59.56,18.94 62.1,18.94
N$50  (via drill 0.89 pad 1.27)  (1 unrouted)
  other vias: 64.64,18.94 67.18,18.94
N$51  (via drill 0.89 pad 1.27)  (2 unrouted)
  other vias: 69.72,18.94 72.26,18.94 74.8,18.94
N$52  (via drill 0.89 pad 1.27)  (1 unrouted)
  other vias: 44.32,16.4 46.86,16.4
N$53  (via drill 0.89 pad 1.27)  (1 unrouted)
  other vias: 49.4,16.4 51.94,16.4
N$54  (via drill 0.89 pad 1.27)  (1 unrouted)
  other vias: 54.48,16.4 57.02,16.4
N$55  (via drill 0.89 pad 1.27)  (1 unrouted)
  other vias: 59.56,16.4 62.1,16.4
N$56  (via drill 0.89 pad 1.27)  (1 unrouted)
  other vias: 64.64,16.4 67.18,16.4
N$57  (via drill 0.89 pad 1.27)  (2 unrouted)
  other vias: 69.72,16.4 72.26,16.4 74.8,16.4
SCK  (via drill 0.33)  (1 unrouted)
  Top 0.203: 32U4.9 21.09,22.49 20.07,22.49 19.05,21.48 v18.16,21.48
  Bottom 0.203: 20.7,11.83 20.7,18.56 18.41,20.84 18.41,21.22 v18.16,21.48 18.03,21.61 18.03,23.38 18.41,23.76 18.41,29.86 25.4,36.85 32.64,36.85 33.18,36.31 U$3.13 | 20.7,11.83 20.7,10.05 25.02,5.73 25.27,5.73 | ICSP.3 16.51,11.83 20.7,11.83
SENSOR_LED  (via drill 0.33 pad 0.64)  (1 unrouted)
  Top 0.203: v35.43,13.6 36.32,13.6 36.45,13.73 | ROUTER.16 32.77,8.26 v32.77,8.4
  Bottom 0.203: v35.43,13.6 35.43,11.57 34.04,10.18 34.04,8.91 33.53,8.4 v32.77,8.4
SS  (via drill 0.33, 0.33 pad 0.61, 0.6)  (1 unrouted)
  Top 0.203: 19.83,23.02 32U4.8 19.19,23.02 v18.92,22.62 | v24.13,8.78 23.49,9.29 23.24,9.29
  Bottom 0.203: U$3.14 31.42,34.26 29.34,36.34 25.78,36.34 18.92,29.48 v18.92,22.62 19.18,22.37 19.18,20.97 21.21,18.94 21.21,10.3 22.73,8.78 v24.13,8.78
  Bottom 0.305: U$3.14 33.18,34.56 v32.51,34.43
UART_RXD  (via drill 0.33 pad 0.64)  (2 unrouted)
  Top 0.203: ROUTER.14 30.23,5.99 30.99,6.75 31,8.91 31.62,9.54 31.62,10.56 | U6.2 39.76,11.45 39.37,11.83 37.72,11.83 v36.83,10.94
  Bottom 0.203: 30.23,5.86 31.88,7.51 33.53,7.51 34.54,8.52 34.54,9.92 35.56,10.94 v36.83,10.94
UART_RXD1
  Top 0.203: 30.86,19.07 28.19,19.07 27.94,19.32 26.67,19.32 25.91,20.08 25.91,20.72 32U4.20
  Top 0.254: 30.86,19.07 32.13,17.67 32.13,13.31 U2.6
UART_TXD  (via drill 0.33 pad 0.64)
  Top 0.203: ROUTER.13 30.23,3.83 31.5,5.1 31.5,8.65 32.13,9.29 32.13,10.6 U2.3 | U6.3 40.26,10.3 40.01,9.67 36.2,9.67 v36.07,9.92
  Bottom 0.203: v36.07,9.92 35.43,9.92 35.05,9.67 35.05,8.27 33.78,7 32.26,7 31.5,6.24 31.5,5.1 30.23,3.83 30.23,3.45 30.35,3.32 ROUTER.13 30.23,3.32
UART_TXD1  (1 unrouted)
  Top 0.203: 32.64,13.32 U2.5 | 31.24,19.57 28.45,19.57 28.19,19.83 26.92,19.83 26.42,20.34 26.42,20.59
  Top 0.254: U2.5 32.63,18.06 31.24,19.57
USB_N
  Top 0.254: 32U4.3 19.49,25.52 19.26,25.75 14.86,25.75 14.71,25.89 R8.1
USB_P
  Top 0.254: 32U4.4 19.41,25.02 19.09,25.34 14.86,25.34 14.47,24.95 R9.1
USB_VCC  (via drill 0.61 pad 0.81)
  Top 0.254: 32U4.7 18.42,23.52 17.53,22.62 16.89,22.62 16.76,22.49 | 19.94,26.05 19.94,26.18 | 32U4.2 20.1,26.02 19.81,26.3 19.82,26.31
  Top 0.406: 19.94,26.18 19.82,26.31 19.18,27.07 12.07,27.07 12.07,28.46 v8.13,28.46 7.87,28.21 5.84,28.21 5.84,27.06 J1.P1 | 9.52,21.48 16.71,21.48 C17.2 16.76,22.49 | YSSR05.4 9.4,24.35 v9.4,23 9.4,21.48 | 9.4,21.48 8.51,21.48 8.51,19.83 8.37,19.83 C1.+ | C2.1 9.52,21.42 9.52,21.48 | 9.52,21.48 9.4,21.48 | 9.4,21.48 9.4,21.35 9.52,21.35
  Bottom 0.406: v8.13,28.46 9.4,28.46 v9.4,23
XTAL1
  Top 0.203: 32U4.17 24.38,19.11 25.02,18.47 25.02,17.92 25.06,17.92 R16.2 26.13,16.85 X1.3
  Top 0.254: X1.3 27.71,16.38 C14.2
XTAL2
  Top 0.203: 32U4.16 23.88,20.74 23.88,18.19 R16.1 24.27,17.92 24.38,17.92 24.3,17.84 24.3,17.63 24.89,17.03 24.89,15.59 X1.1 23.4,14.53 22.73,13.86 22.73,13.22 22.61,13.22 22.62,13.23 C9.2

### Text on the board
tDocu: 7A | 1A | 7B | 1B | BEE SOCKET | GND | A5 | A4 | A3 | A2 | A1 | A0 | ~ | 5 | Model: M32W V1.0 | ANALOG IN | SS | DIGITAL (PWM~) | GND | RST | 3V3 | SDA | SCL | GND | 9 | 10 | 4 | 12 | 6 | 8 | ~ | ~ | ~ | MOSI | SCK | 3V3 | MISO | Wireless IoT Module
214bmp: D:/SmartProjects/Snc/a4_bn_logo2.bmp